# Altium schematic sheet device-pdm.SchDoc
size 297 x 209 mm
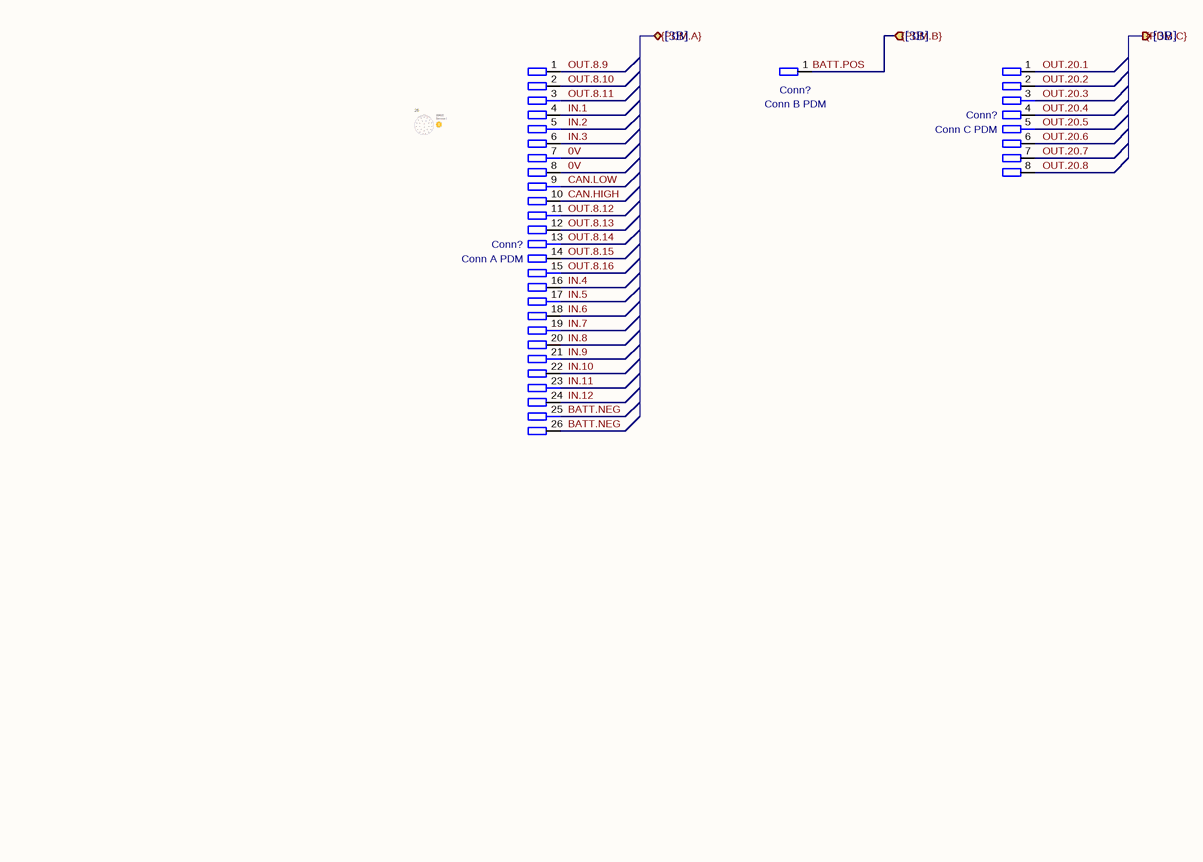
[diagram p0: device-pdm.SchDoc]

## Parts
(Parts that share a designator on the sheet are numbered #1, #2 ... from top to bottom, then left to right.)
Conn?#1  Conn A PDM
Conn?#2  Conn B PDM
Conn?#3  Conn C PDM

## Ports
{PDM.A} (bidir, see [3B]), {PDM.B} (in, see [3B]), {PDM.C} (out, see [3B])

## Nets
0V: Conn?#1.7 Conn?#1.8
BATT.NEG: Conn?#1.25 Conn?#1.26
BATT.POS: Conn?#2.1 ; port {PDM.B}
CAN.HIGH: Conn?#1.10
CAN.LOW: Conn?#1.9
IN.1: Conn?#1.4
IN.2: Conn?#1.5
IN.3: Conn?#1.6
IN.4: Conn?#1.16
IN.5: Conn?#1.17
IN.6: Conn?#1.18
IN.7: Conn?#1.19
IN.8: Conn?#1.20
IN.9: Conn?#1.21
IN.10: Conn?#1.22
IN.11: Conn?#1.23
IN.12: Conn?#1.24
OUT.8.9: Conn?#1.1
OUT.8.10: Conn?#1.2
OUT.8.11: Conn?#1.3
OUT.8.12: Conn?#1.11
OUT.8.13: Conn?#1.12
OUT.8.14: Conn?#1.13
OUT.8.15: Conn?#1.14
OUT.8.16: Conn?#1.15
OUT.20.1: Conn?#3.1
OUT.20.2: Conn?#3.2
OUT.20.3: Conn?#3.3
OUT.20.4: Conn?#3.4
OUT.20.5: Conn?#3.5
OUT.20.6: Conn?#3.6
OUT.20.7: Conn?#3.7
OUT.20.8: Conn?#3.8

## Notes on the sheet
- 1
- 2
- 3
- 4
- 5
- 6
- A
- B
- C
- D
- Title: DEVICE - PDM
- File: device-pdm.kicad_sch
- Sheet: /
- KiCad E.D.A.  kicad (5.1.4)-1
- Size: A4
- Date:
- Rev:
- Id: 1/1

## Library data of the parts
Conn?#1 = Conn A PDM: Value: Conn A PDM
Conn?#2 = Conn B PDM: Value: Conn B PDM
Conn?#3 = Conn C PDM: Value: Conn C PDM